# EAGLE design neojoint3-090 (EAGLE 6.6.0)
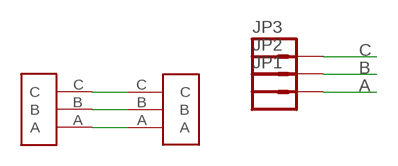
[diagram p0: schematic, sheet 1]

## Parts
JP1  M01PTH  [1X01]
JP2  M01PTH  [1X01]
JP3  M01PTH  [1X01]
U$1  LED_STRIP_3P  [LEDSTRIP-3P]
U$2  LED_STRIP_3P  [LEDSTRIP-3P]

## Nets
A: JP1.1 U$1.A U$2.A
B: JP2.1 U$1.B U$2.B
C: JP3.1 U$1.C U$2.C

## Library data of the parts
JP1-JP3 = SparkFun-Connectors:M01: Header 1 Standard 1-pin 0.1" header. Use with straight break away headers (SKU : PRT-00116), right angle break away headers (PRT-00553), swiss pins (PRT-00743), machine pins (PRT-00117), and female headers (PRT-00115).
U$1 U$2 = todstuff:LED_STRIP_3P

## Board
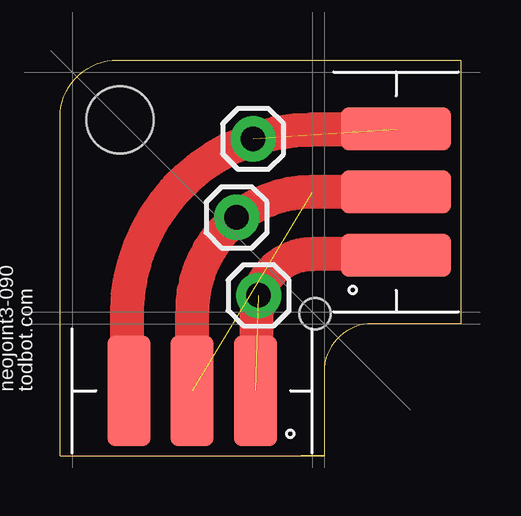
[diagram p1: board, top side]

Size 16.7 x 16.5 mm. Coordinates in mm from the lower left corner, seen from the top.
Outline: 10.03,0 0,0 0,13.9 0,14.1 arc-90 2.4,16.5 16.7,16.5 16.7,5.5 13,5.5 arc90 11,3.5 11,0
Outline: 10.03,0 11,0
Outline: 11,0 10.03,0
Copper layers (1*16): Top 0.0356mm / dielectric 1.5011mm / Bottom 0.0356mm
Design rules "LaenPCBOrder-tod": minimum track width 10mil, minimum drill 13mil, track to track 6mil, track to pad 8mil, pad to pad 8mil, via to via 8mil, smd to smd 6mil, copper to edge 15mil, drill to drill 8mil, minimum pad ring 7mil, minimum via ring 7mil, stop-mask expansion 4mil, vias tented up to drill 25mil, thermal gap 10mil
Holes 2.8 mm at 2.5,14
Holes 1.3 mm at 10.62,5.92

### Footprints (pad centres in the part's own frame; a part is rotated, then mirrored left to right if it is on the bottom)
1X01 = drill 1.016 pad 1.88: 1 0,0
LEDSTRIP-3P = smd 4.6 x 1.8: A 0,-2.65; B 0,0; C 0,2.63

### Placement (x,y rotation side)
JP1  8.28,6.68 0 top
JP2  7.36,9.94 0 top
JP3  8.05,13.21 0 top
U$1  5.5,2.7 90 top
U$2  14,11 0 top

### Tracks (layer width: path | path; a pad name or v marks a point on that pad's centre or on a via)
A  (1 unrouted)
  Top 1.422: U$2.A 14,8.4 10.5,8.4 arc92 8.2,6 8.2,2.7 U$1.A
B  (1 unrouted)
  Top 1.422: U$2.B 10.5,11 arc91 5.5,5.9 U$1.B
C  (1 unrouted)
  Top 1.422: U$2.C 14,13.6 10.5,13.6 arc90 2.8,5.9 2.8,2.7 U$1.C

### Text on the board
tPlace: neojoint3-090 | todbot.com